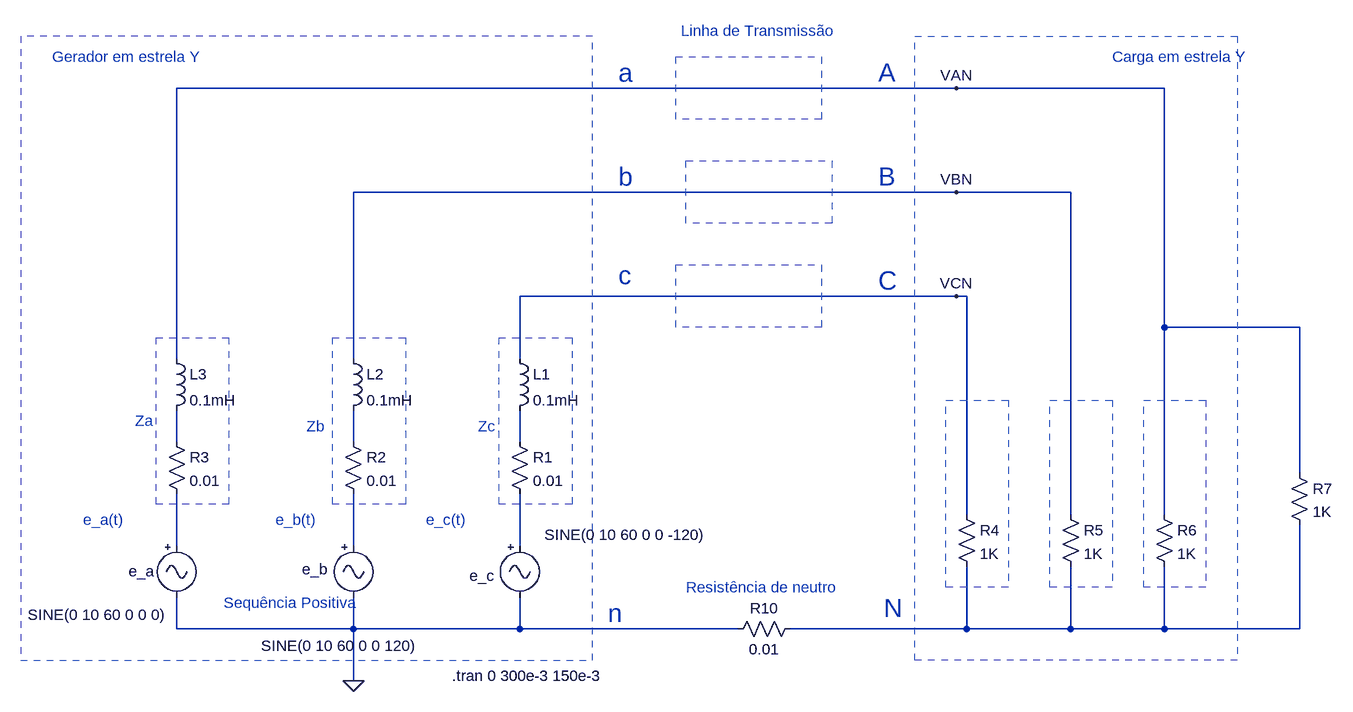
[diagram p0: schematic GeradorYCargaYLinha_3_3_2.asc]
GeradorYCargaYLinha_3_3_2.asc, the LTspice schematic file:
Version 4
SHEET 1 1048 680
WIRE 320 -688 -880 -688
WIRE 640 -688 320 -688
WIRE 320 -528 -608 -528
WIRE 496 -528 320 -528
WIRE 320 -368 -352 -368
WIRE 336 -368 320 -368
WIRE 640 -320 640 -688
WIRE 848 -320 640 -320
WIRE -880 -272 -880 -688
WIRE -608 -272 -608 -528
WIRE -352 -272 -352 -368
WIRE -880 -144 -880 -192
WIRE -608 -144 -608 -192
WIRE -352 -144 -352 -192
WIRE 848 -96 848 -320
WIRE 336 -32 336 -368
WIRE 496 -32 496 -528
WIRE 640 -32 640 -320
WIRE -880 16 -880 -64
WIRE -608 16 -608 -64
WIRE -352 16 -352 -64
WIRE -880 144 -880 96
WIRE -608 144 -608 96
WIRE -608 144 -880 144
WIRE -352 144 -352 96
WIRE -352 144 -608 144
WIRE -16 144 -352 144
WIRE 336 144 336 48
WIRE 336 144 64 144
WIRE 496 144 496 48
WIRE 496 144 336 144
WIRE 640 144 640 48
WIRE 640 144 496 144
WIRE 848 144 848 -16
WIRE 848 144 640 144
WIRE -608 224 -608 144
FLAG -608 224 0
FLAG 320 -688 VAN
FLAG 320 -528 VBN
FLAG 320 -368 VCN
SYMBOL Misc\\signal -880 0 R0
WINDOW 0 -74 55 Left 2
WINDOW 3 -229 122 Left 2
WINDOW 123 0 0 Left 0
WINDOW 39 0 0 Left 0
SYMATTR InstName e_a
SYMATTR Value SINE(0 10 60 0 0 0)
SYMBOL Misc\\signal -608 0 R0
WINDOW 0 -79 52 Left 2
WINDOW 3 -142 170 Left 2
WINDOW 123 0 0 Left 0
WINDOW 39 0 0 Left 0
SYMATTR InstName e_b
SYMATTR Value SINE(0 10 60 0 0 120)
SYMBOL Misc\\signal -352 0 R0
WINDOW 0 -77 62 Left 2
WINDOW 3 38 -1 Left 2
WINDOW 123 0 0 Left 0
WINDOW 39 0 0 Left 0
SYMATTR InstName e_c
SYMATTR Value SINE(0 10 60 0 0 -120)
SYMBOL res 320 -48 R0
SYMATTR InstName R4
SYMATTR Value 1K
SYMATTR SpiceLine pwr=0.25
SYMBOL res 480 -48 R0
SYMATTR InstName R5
SYMATTR Value 1K
SYMATTR SpiceLine pwr=0.25
SYMBOL res 624 -48 R0
SYMATTR InstName R6
SYMATTR Value 1K
SYMATTR SpiceLine pwr=0.25
SYMBOL res -368 -160 R0
SYMATTR InstName R1
SYMATTR Value 0.01
SYMBOL res -624 -160 R0
SYMATTR InstName R2
SYMATTR Value 0.01
SYMBOL res -896 -160 R0
SYMATTR InstName R3
SYMATTR Value 0.01
SYMBOL ind -368 -288 R0
SYMATTR InstName L1
SYMATTR Value 0.1mH
SYMBOL ind -624 -288 R0
SYMATTR InstName L2
SYMATTR Value 0.1mH
SYMBOL ind -896 -288 R0
SYMATTR InstName L3
SYMATTR Value 0.1mH
SYMBOL res 80 128 R90
WINDOW 0 0 56 VBottom 2
WINDOW 3 32 56 VTop 2
SYMATTR InstName R10
SYMATTR Value 0.01
SYMBOL res 832 -112 R0
SYMATTR InstName R7
SYMATTR Value 1K
SYMATTR SpiceLine pwr=0.25
TEXT -456 216 Left 2 !.tran 0 300e-3 150e-3
TEXT -1024 -24 Left 2 ;e_a(t)
TEXT -728 -24 Left 2 ;e_b(t)
TEXT -496 -24 Left 2 ;e_c(t)
TEXT -808 104 Left 2 ;Sequência Positiva
TEXT -944 -176 Left 2 ;Za
TEXT -680 -168 Left 2 ;Zb
TEXT -416 -168 Left 2 ;Zc
TEXT 560 -736 Left 2 ;Carga em estrela Y
TEXT -96 80 Left 2 ;Resistência de neutro
TEXT -216 120 Left 4 ;n
TEXT 208 112 Left 4 ;N
TEXT -1072 -736 Left 2 ;Gerador em estrela Y
TEXT -104 -776 Left 2 ;Linha de Transmissão
TEXT -200 -712 Left 4 ;a
TEXT -200 -552 Left 4 ;b
TEXT -200 -400 Left 4 ;c
TEXT 200 -712 Left 4 ;A
TEXT 200 -552 Left 4 ;B
TEXT 200 -392 Left 4 ;C
RECTANGLE Normal -800 -48 -912 -304 2
RECTANGLE Normal -528 -48 -640 -304 2
RECTANGLE Normal -272 -48 -384 -304 2
RECTANGLE Normal -1120 192 -240 -768 2
RECTANGLE Normal 112 -320 -112 -416 2
RECTANGLE Normal 128 -480 -96 -576 2
RECTANGLE Normal 112 -640 -112 -736 2
RECTANGLE Normal 400 80 304 -208 2
RECTANGLE Normal 560 80 464 -208 2
RECTANGLE Normal 704 80 608 -208 2
RECTANGLE Normal 752 192 256 -768 2

The netlist it stands for:
* GeradorYCargaYLinha_3_3_2.asc
V§e_a N004 0 SINE(0 10 60 0 0 0)
V§e_b N005 0 SINE(0 10 60 0 0 120)
V§e_c N006 0 SINE(0 10 60 0 0 -120)
R4 VCN N007 1K pwr=0.25
R5 VBN N007 1K pwr=0.25
R6 VAN N007 1K pwr=0.25
R1 N003 N006 0.01
R2 N002 N005 0.01
R3 N001 N004 0.01
L1 VCN N003 0.1mH
L2 VBN N002 0.1mH
L3 VAN N001 0.1mH
R10 N007 0 0.01
R7 VAN N007 1K pwr=0.25
.tran 0 300e-3 150e-3
* e_a(t)
* e_b(t)
* e_c(t)
* Sequência Positiva
* Za
* Zb
* Zc
* Carga em estrela Y
* Resistência de neutro
* n
* N
* Gerador em estrela Y
* Linha de Transmissão
* a
* b
* c
* A
* B
* C
.backanno
.end